# EAGLE design sensori di linea soccer 2018 (EAGLE 8.5.2)
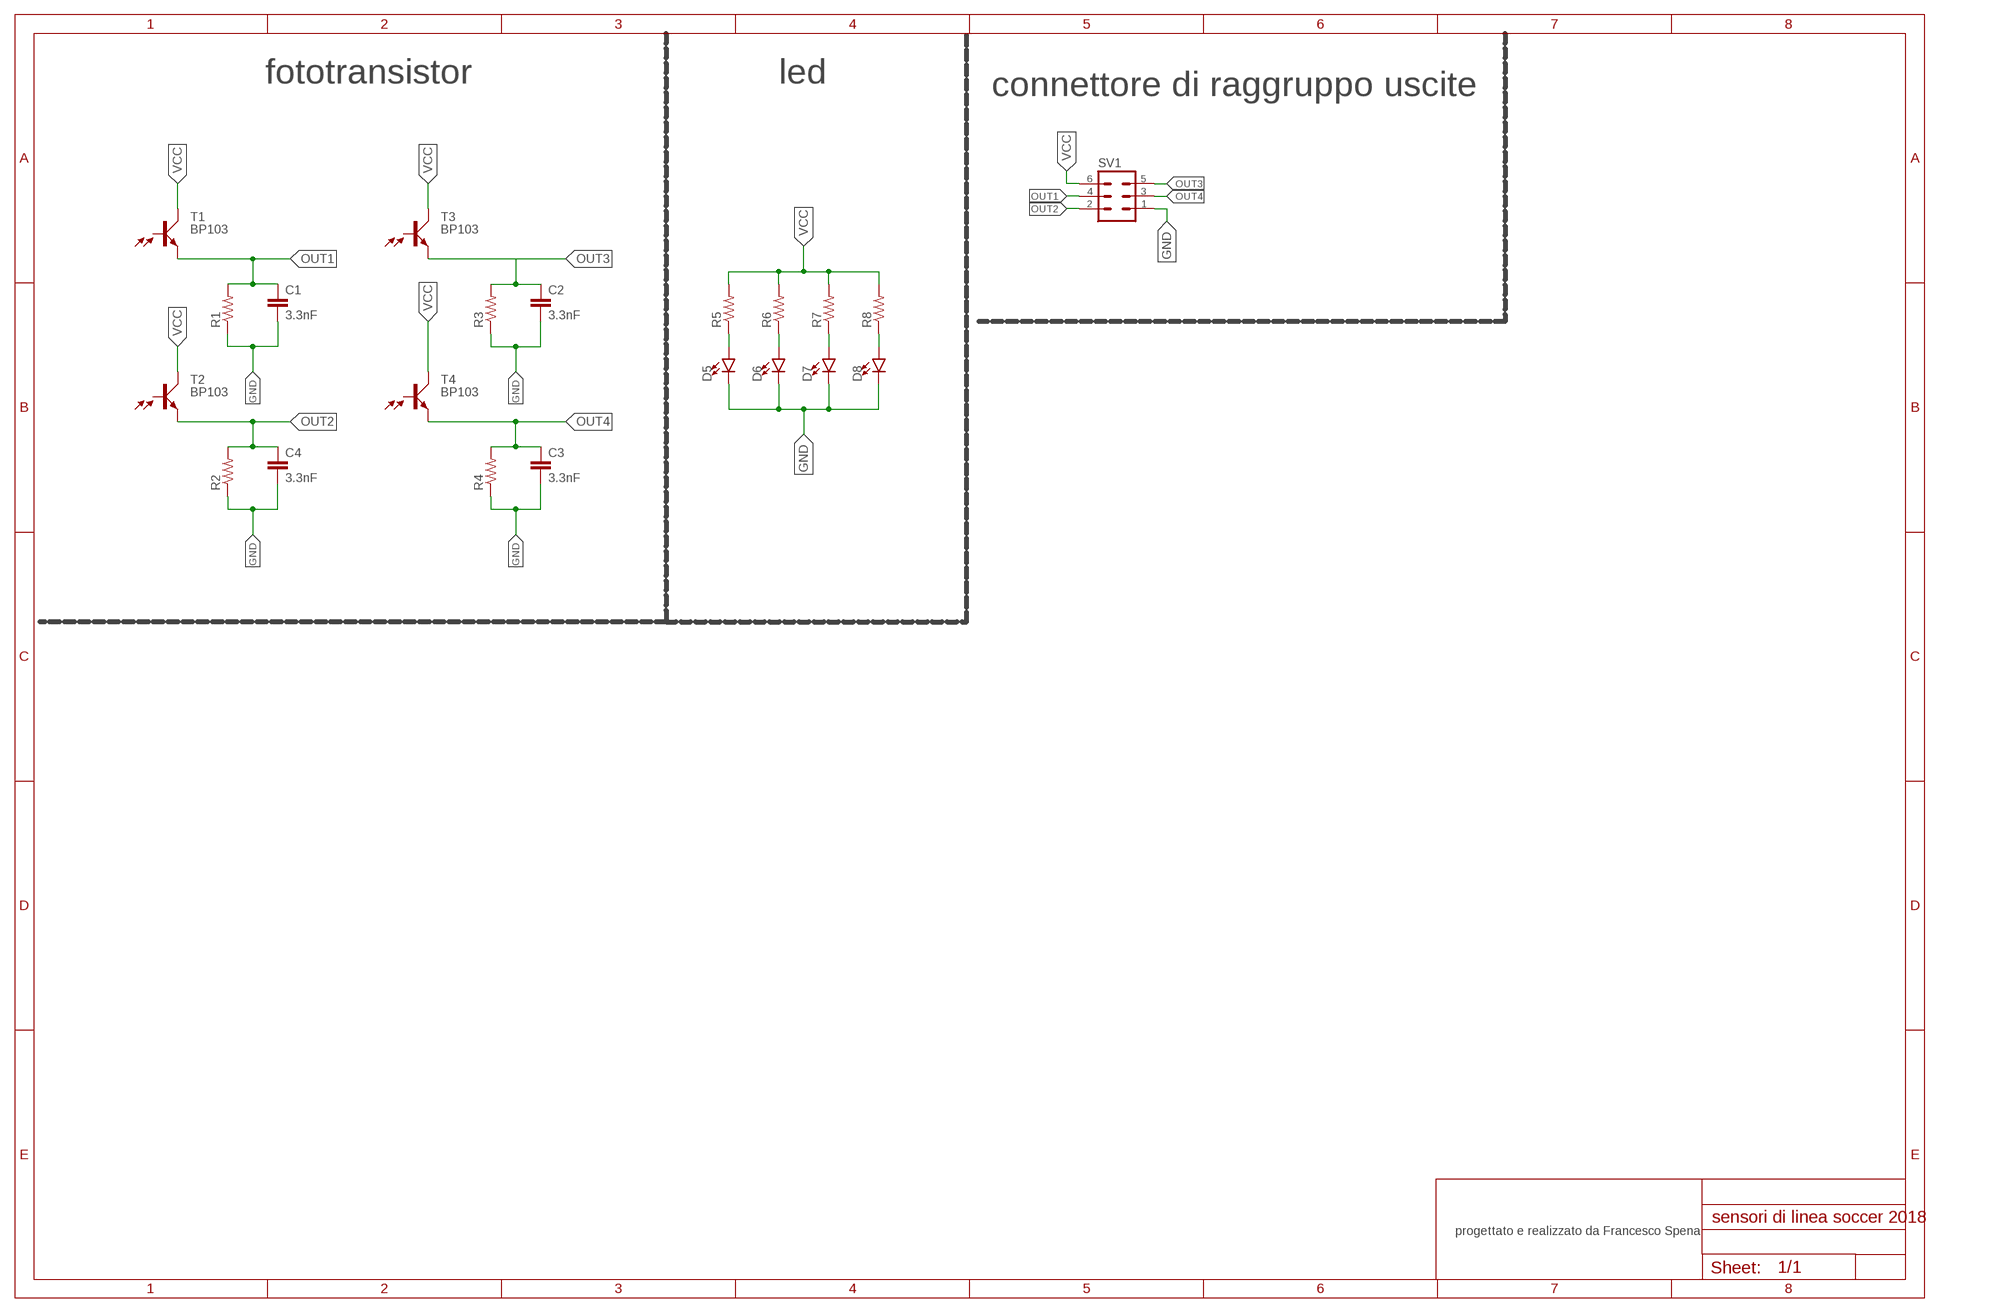
[diagram p0: schematic, sheet 1]

## Parts
C1  3.3nF  3.3NF-0603-100V-10%  [0603]
C2  3.3nF  3.3NF-0603-100V-10%  [0603]
C3  3.3nF  3.3NF-0603-100V-10%  [0603]
C4  3.3nF  3.3NF-0603-100V-10%  [0603]
D5  LED3MM  [LED_3MM]
D6  LED3MM  [LED_3MM]
D7  LED3MM  [LED_3MM]
D8  LED3MM  [LED_3MM]
R1  R-US_0204/7  [0204/7]
R2  R-US_0204/7  [0204/7]
R3  R-US_0204/7  [0204/7]
R4  R-US_0204/7  [0204/7]
R5  R-US_0204/7  [0204/7]
R6  R-US_0204/7  [0204/7]
R7  R-US_0204/7  [0204/7]
R8  R-US_0204/7  [0204/7]
SV1  MA03-2  [MA03-2]
T1  BP103  [BP103]
T2  BP103  [BP103]
T3  BP103  [BP103]
T4  BP103  [BP103]

## Nets
GND: C1.2 C2.2 C3.2 C4.2 D5.K(C) D6.K(C) D7.K(C) D8.K(C) R1.1 R2.1 R3.1 R4.1 SV1.1
N$2: D5.A R5.1
N$3: D6.A R6.1
N$4: D7.A R7.1
N$5: D8.A R8.1
OUT1: C1.1 R1.2 SV1.4 T1.E
OUT2: C4.1 R2.2 SV1.2 T2.E
OUT3: C2.1 R3.2 SV1.5 T3.E
OUT4: C3.1 R4.2 SV1.3 T4.E
VCC: R5.2 R6.2 R7.2 R8.2 SV1.6 T1.C T2.C T3.C T4.C
Unconnected: T1.B T2.B T3.B T4.B

## Notes on the sheet
- fototransistor | led
- connettore di raggruppo uscite
- progettato e realizzato da Francesco Spena

## Library data of the parts
C1-C4 = SparkFun-Capacitors:3.3NF: 3.3nF ceramic capacitors A capacitor is a passive two-terminal electrical component used to store electrical energy temporarily in an electric field.; PROD_ID: CAP-09633
D5-D8 = SparkFun-LED:LED: LED (Generic) Standard schematic elements and footprints for 5mm, 3mm, 1206, and 0603 sized LEDs. Generic LEDs with no color specified.; PROD_ID: DIO-08794
R1-R4 = resistor:R-US_: RESISTOR, American symbol
R5-R8 = rcl:R-US_: RESISTOR, American symbol
SV1 = con-lstb:MA03-2: PIN HEADER; OC_FARNELL: unknown; OC_NEWARK: unknown
T1-T4 = opto-trans-siemens:BP103: PHOTO TRANSISTOR; OC_FARNELL: unknown; OC_NEWARK: unknown

## Board
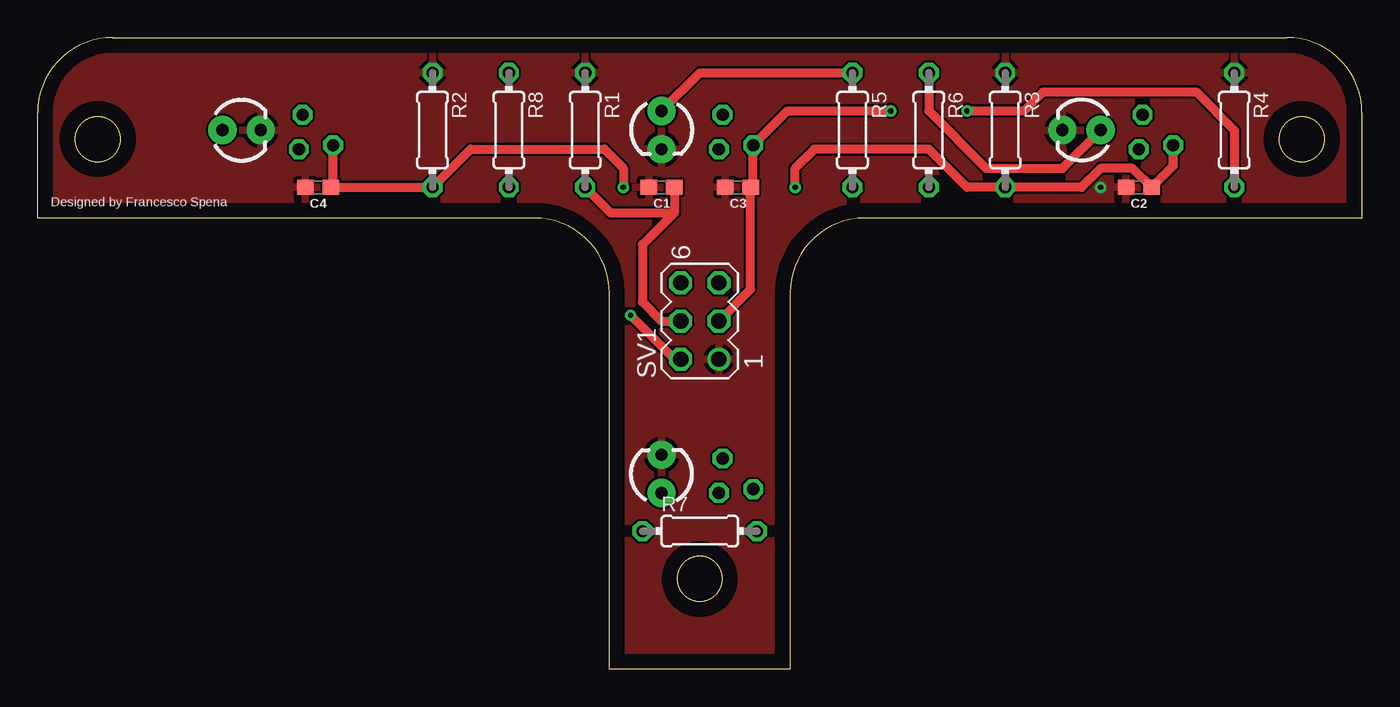
[diagram p1: board, top side]
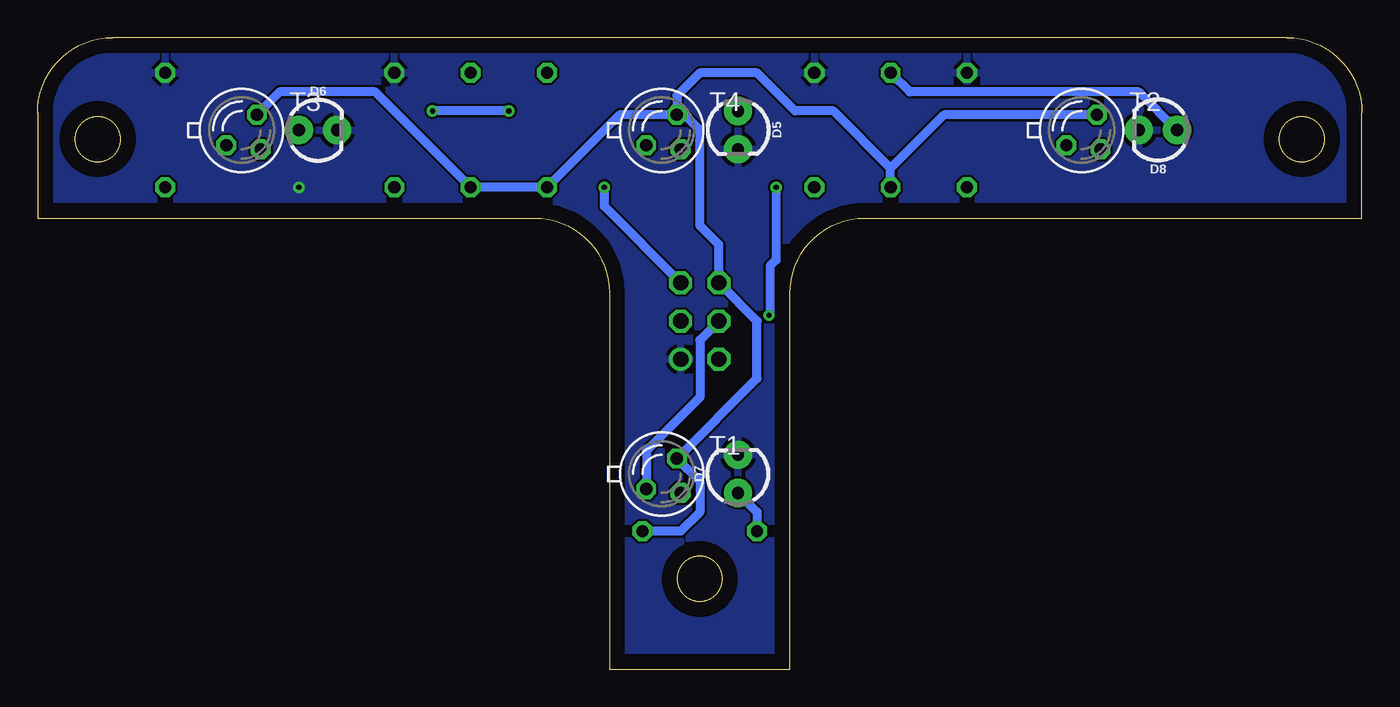
[diagram p2: board, bottom side, seen from below]

Size 88.1 x 42 mm. Coordinates in mm from the lower left corner, seen from the top.
Outline: 50.05,0 38.05,0 38.05,25 arc90 33.05,30 0,30 0,37 arc-90 5,42 83.1,42 arc-90 88.1,37 88.1,30 55.05,30 arc90 50.05,25 50.05,0
Outline: circle at 4,35.25 radius 1.5
Outline: circle at 84.1,35.25 radius 1.5
Outline: circle at 44.05,6 radius 1.5
Copper layers (1*16): Top 0.035mm / dielectric 1.5mm / Bottom 0.035mm
Design rules "default": minimum track width 6mil, minimum drill 0.35mm, track to track 6mil, track to pad 6mil, pad to pad 6mil, via to via 6mil, smd to smd 6mil, copper to edge 40mil, drill to drill 6mil, minimum pad ring 10mil, minimum via ring 8mil, stop-mask expansion 4mil, vias tented up to drill 0mil, thermal gap 10mil

### Footprints (pad centres in the part's own frame; a part is rotated, then mirrored left to right if it is on the bottom)
0603 = smd 1.1 x 1: 1 -0.85,0; 2 0.85,0
LED_3MM = drill 0.813 pad 1.88: A -1.27,0; K 1.27,0
0204/7 = drill 0.813 octagon: 1 -3.81,0; 2 3.81,0
MA03-2 = drill 1.016: 1 -2.54,-1.27 | drill 1.016 octagon: 2 -2.54,1.27; 3 0,-1.27; 4 0,1.27; 5 2.54,-1.27; 6 2.54,1.27
BP103 = drill 0.813 octagon: B 1.27,-1.27; C 1.016,1.016; E -1.016,-1.016

### Placement (x,y rotation side)
C1  41.51,32.04 180 top
C2  73.26,32.04 180 top
C3  46.59,32.04 180 top
C4  18.65,32.04 180 top
D5  41.51,35.85 270 bottom
D6  69.45,35.85 0 bottom
D7  41.51,12.99 90 bottom
D8  13.57,35.85 180 bottom
R1  36.43,35.85 270 top
R2  26.27,35.85 270 top
R3  64.37,35.85 270 top
R4  79.61,35.85 270 top
R5  54.21,35.85 270 top
R6  59.29,35.85 270 top
R7  44.05,9.18 0 top
R8  31.35,35.85 270 top
SV1  44.05,23.15 90 top
T1  46.59,12.99 0 bottom
T2  18.65,35.85 0 bottom
T3  74.53,35.85 0 bottom
T4  46.59,35.85 0 bottom

### Tracks (layer width: path | path; a pad name or v marks a point on that pad's centre or on a via)
GND  (via drill 0.35)
  other vias: 70.72,32.04
  pour Top: 46.59,46.01 -1.67,46.01 -1.67,-2.25 91.04,-2.25 91.04,46.01
  pour Bottom: 27.54,46.01 -1.67,46.01 -1.67,-2.25 91.04,-2.25 91.04,46.01
N$2
  Top 0.61: D5.A 44.05,39.66 R5.1
N$3
  Top 0.61: R6.1 59.29,37.12 63.1,33.31 68.18,33.31 D6.A
N$4
  Bottom 0.61: D7.A 40.24,10.45 R7.1
N$5
  Bottom 0.61: D8.A 14.84,38.39 30.08,38.39 R8.1
OUT1
  Top 0.61: C1.1 42.36,30.35 | 42.36,30.35 40.24,28.23 40.24,24.42 41.51,23.15 SV1.4 | R1.2 38.12,30.35 42.36,30.35
  Bottom 0.61: SV1.4 44.05,21.88 44.05,18.07 47.61,14.51 T1.E
OUT2  (via drill 0.35)
  Top 0.61: T2.E 19.67,32.21 C4.1 R2.2 28.81,34.58 37.7,34.58 38.97,33.31 v38.97,32.04 | v39.45,23.54 42.37,20.61 SV1.2
  Bottom 0.61: v38.97,32.04 38.97,27.22 39.37,26.82 39.37,23.61 v39.45,23.54
OUT3  (via drill 0.35)
  Top 0.61: v50.4,32.04 50.4,33.31 51.67,34.58 59.29,34.58 61.83,32.04 R3.2 69.45,32.04 70.72,33.31 72.84,33.31 C2.1 75.55,33.48 T3.E
  Bottom 0.61: SV1.5 50.4,30.77 v50.4,32.04
OUT4  (via drill 0.35)
  Top 0.61: SV1.3 47.44,25.27 C3.1 47.61,32.21 T4.E 49.89,37.12 v56.75,37.12 | v61.83,37.12 65.64,37.12 66.91,38.39 77.07,38.39 79.61,35.85 R4.2
  Bottom 0.61: v56.75,37.12 v61.83,37.12
VCC
  Bottom 0.61: T2.C 27.8,36.87 31.35,33.31 | R8.2 31.35,33.31 | 31.35,33.31 35.16,37.12 37.7,37.12 40.24,39.66 44.05,39.66 45.58,38.14 T4.C | T4.C 49.39,36.87 R5.2 R6.2 65.64,38.39 71.99,38.39 T3.C | T4.C 45.07,36.87 44.05,35.85 44.05,29.5 42.78,28.23 SV1.6 40.24,23.15 40.24,19.34 T1.C 44.05,12.48 44.05,10.45 45.32,9.18 R7.2

### Text on the board
tPlace: Designed by Francesco Spena